# EAGLE design ADDR_ADDR_1 (EAGLE 6.5.0)
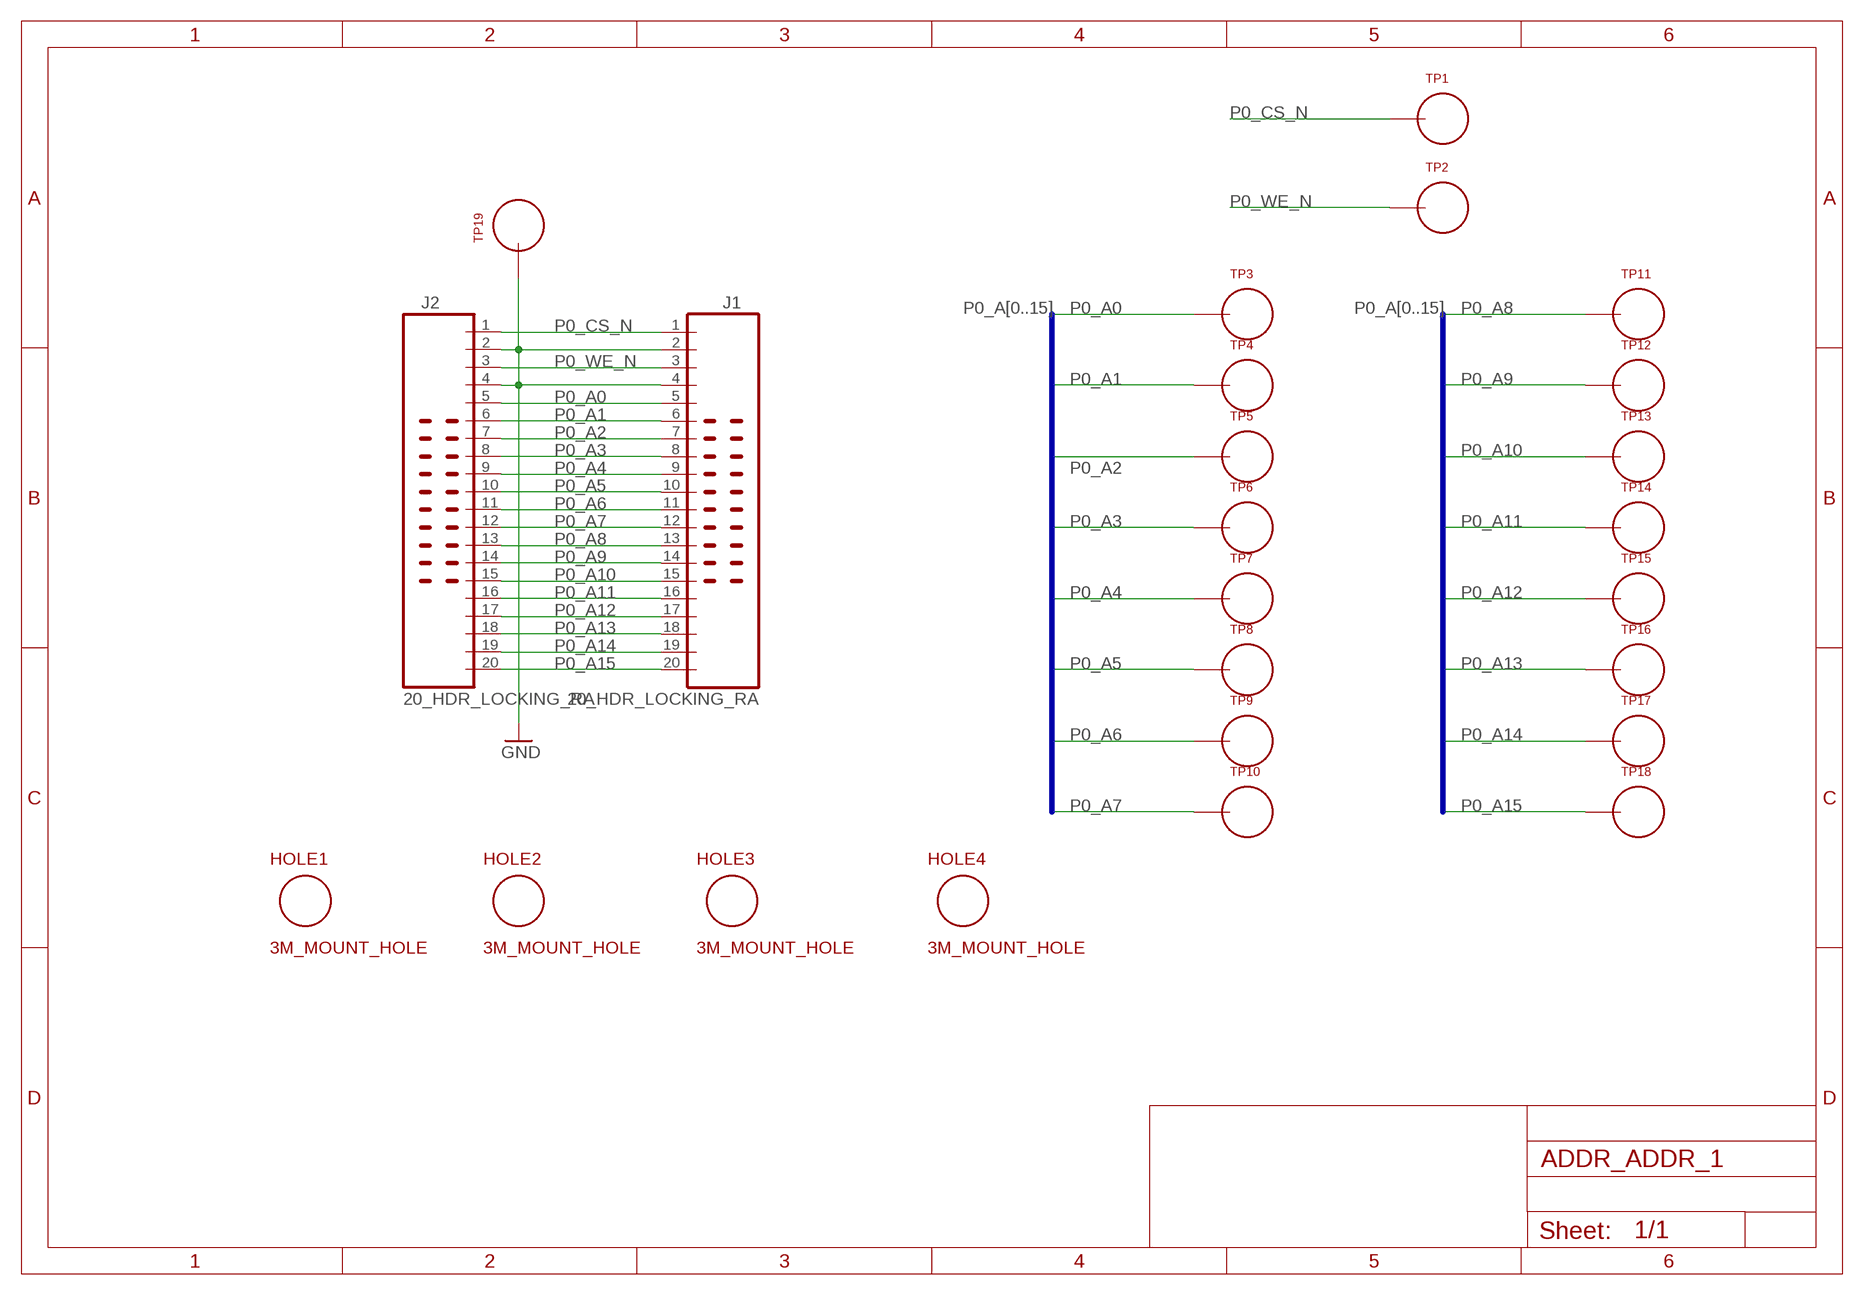
[diagram p0: schematic, sheet 1]

## Parts
HOLE1  3M_MOUNT_HOLE  [3M_HOLE]
HOLE2  3M_MOUNT_HOLE  [3M_HOLE]
HOLE3  3M_MOUNT_HOLE  [3M_HOLE]
HOLE4  3M_MOUNT_HOLE  [3M_HOLE]
J1  20_HDR_LOCKING_RA  [20_HDR_LOCKING_RA]
J2  20_HDR_LOCKING_RA  [20_HDR_LOCKING_RA]
TP1  TEST_LOOP  [TEST_LOOP]
TP2  TEST_LOOP  [TEST_LOOP]
TP3  TEST_LOOP  [TEST_LOOP]
TP4  TEST_LOOP  [TEST_LOOP]
TP5  TEST_LOOP  [TEST_LOOP]
TP6  TEST_LOOP  [TEST_LOOP]
TP7  TEST_LOOP  [TEST_LOOP]
TP8  TEST_LOOP  [TEST_LOOP]
TP9  TEST_LOOP  [TEST_LOOP]
TP10  TEST_LOOP  [TEST_LOOP]
TP11  TEST_LOOP  [TEST_LOOP]
TP12  TEST_LOOP  [TEST_LOOP]
TP13  TEST_LOOP  [TEST_LOOP]
TP14  TEST_LOOP  [TEST_LOOP]
TP15  TEST_LOOP  [TEST_LOOP]
TP16  TEST_LOOP  [TEST_LOOP]
TP17  TEST_LOOP  [TEST_LOOP]
TP18  TEST_LOOP  [TEST_LOOP]
TP19  TEST_LOOP  [TEST_LOOP]

## Nets
GND: J1.2 J1.4 J2.2 J2.4 TP19.P$1
P0_A0: J1.5 J2.5 TP3.P$1
P0_A1: J1.6 J2.6 TP4.P$1
P0_A2: J1.7 J2.7 TP5.P$1
P0_A3: J1.8 J2.8 TP6.P$1
P0_A4: J1.9 J2.9 TP7.P$1
P0_A5: J1.10 J2.10 TP8.P$1
P0_A6: J1.11 J2.11 TP9.P$1
P0_A7: J1.12 J2.12 TP10.P$1
P0_A8: J1.13 J2.13 TP11.P$1
P0_A9: J1.14 J2.14 TP12.P$1
P0_A10: J1.15 J2.15 TP13.P$1
P0_A11: J1.16 J2.16 TP14.P$1
P0_A12: J1.17 J2.17 TP15.P$1
P0_A13: J1.18 J2.18 TP16.P$1
P0_A14: J1.19 J2.19 TP17.P$1
P0_A15: J1.20 J2.20 TP18.P$1
P0_CS_N: J1.1 J2.1 TP1.P$1
P0_WE_N: J1.3 J2.3 TP2.P$1

## Buses
P0_A[0..15]

## Library data of the parts
HOLE1-HOLE4 = MyLib:3M_MOUNT_HOLE
J1 J2 = MyLib:20_HDR_LOCKING_RA
TP1-TP19 = MyLib:TEST_LOOP

## Board
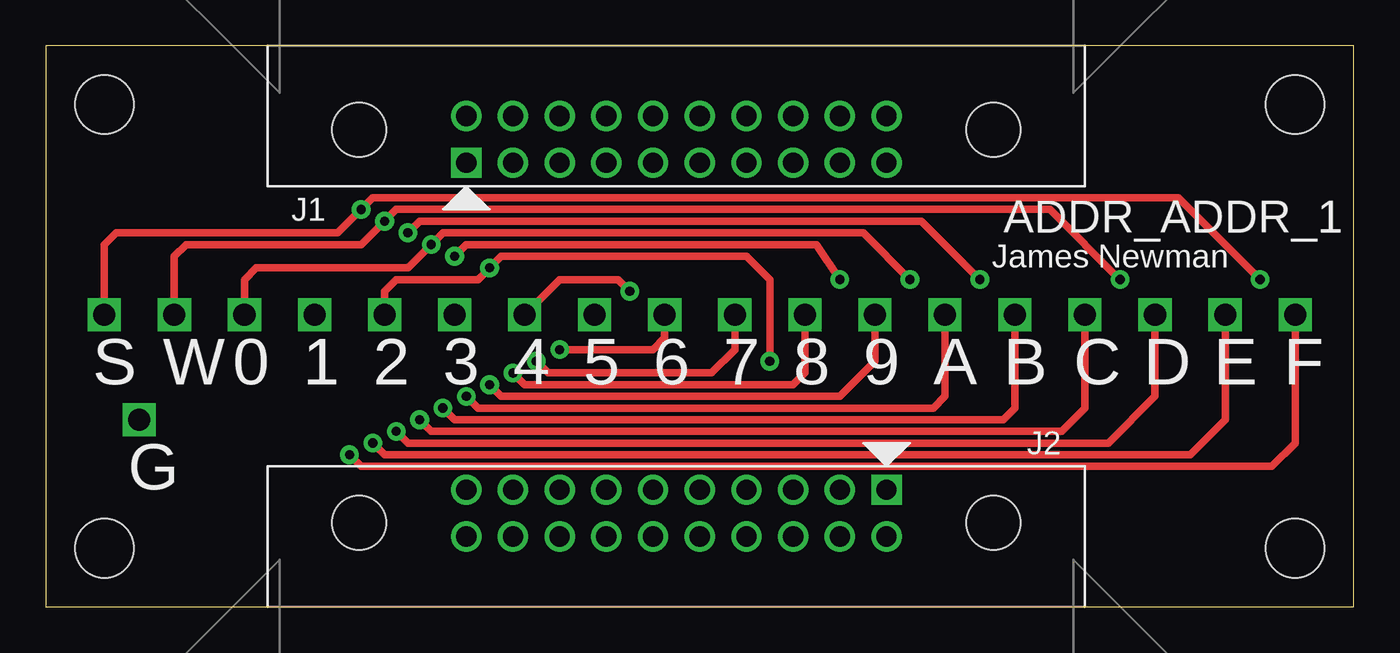
[diagram p1: board, top side]
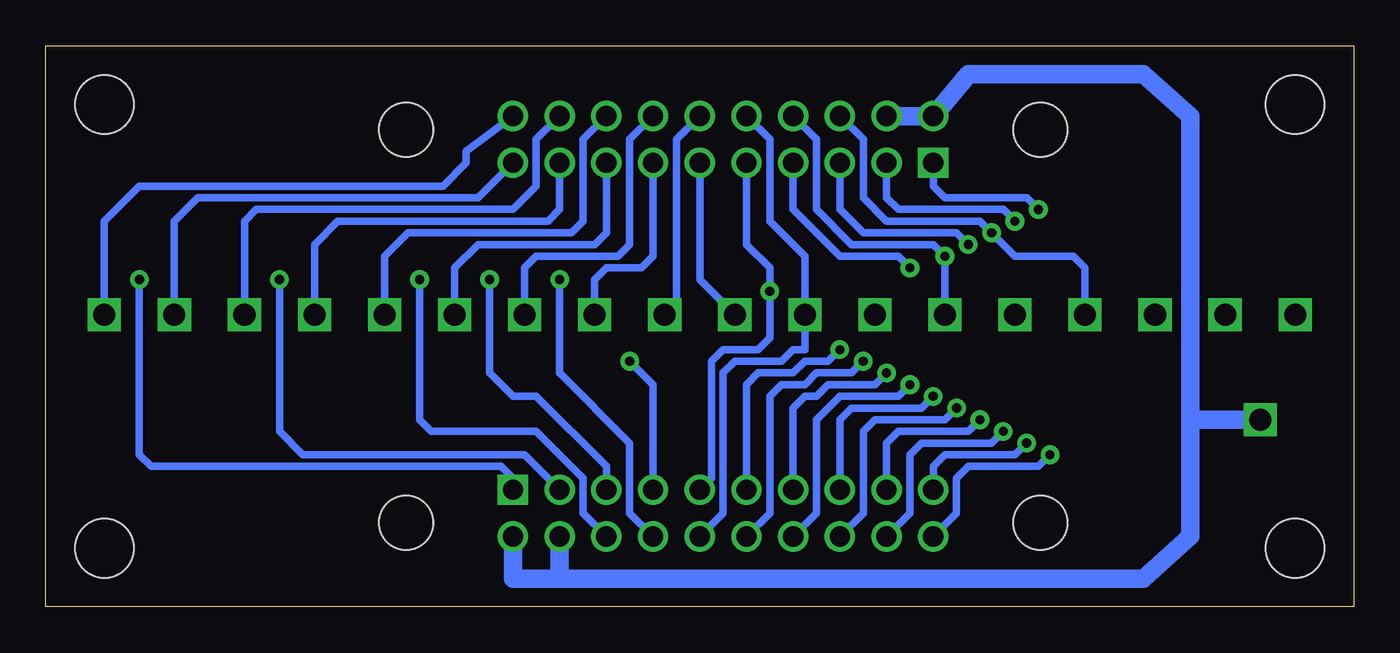
[diagram p2: board, bottom side, seen from below]

Size 71.12 x 30.48 mm. Coordinates in mm from the lower left corner, seen from the top.
Outline: 0,0 71.12,0 71.12,30.48 0,30.48 0,0
Copper layers (1*16): Top 0.035mm / dielectric 1.5mm / Bottom 0.035mm
Design rules "processor_rules_2layer": minimum track width 8mil, minimum drill 14mil, track to track 8mil, track to pad 8mil, pad to pad 8mil, via to via 8mil, smd to smd 8mil, copper to edge 40mil, drill to drill 8mil, minimum pad ring 10mil, minimum via ring 8mil, stop-mask expansion 4mil, vias tented up to drill 0.7mm, thermal gap 10mil

### Footprints (pad centres in the part's own frame; a part is rotated, then mirrored left to right if it is on the bottom)
3M_HOLE = hole 3.2: 0,0
20_HDR_LOCKING_RA = drill 1.1 square: 1 -11.43,-1.27 | drill 1.1: 2 -11.43,1.27; 3 -8.89,-1.27; 4 -8.89,1.27; 5 -6.35,-1.27; 6 -6.35,1.27; 7 -3.81,-1.27; 8 -3.81,1.27; 9 -1.27,-1.27; 10 -1.27,1.27; 11 1.27,-1.27; 12 1.27,1.27; 13 3.81,-1.27; 14 3.81,1.27; 15 6.35,-1.27; 16 6.35,1.27; 17 8.89,-1.27; 18 8.89,1.27; 19 11.43,-1.27; 20 11.43,1.27 | hole 2.946: -17.247,0.533; 17.247,0.533
TEST_LOOP = drill 1.2 square: P$1 0,0

### Placement (x,y rotation side)
HOLE1  3.17,3.17 0 top
HOLE2  3.17,27.3 0 top
HOLE3  67.94,27.3 0 top
HOLE4  67.94,3.17 0 top
J1  34.29,25.4 0 top
J2  34.29,5.08 180 top
TP1  3.17,15.88 90 top
TP2  6.99,15.88 90 top
TP3  10.79,15.88 90 top
TP4  14.61,15.88 90 top
TP5  18.41,15.88 90 top
TP6  22.23,15.88 90 top
TP7  26.04,15.88 90 top
TP8  29.84,15.88 90 top
TP9  33.66,15.88 90 top
TP10  37.47,15.88 90 top
TP11  41.27,15.88 90 top
TP12  45.09,15.88 90 top
TP13  48.9,15.88 90 top
TP14  52.7,15.88 90 top
TP15  56.52,15.88 90 top
TP16  60.33,15.88 90 top
TP17  64.14,15.88 90 top
TP18  67.94,15.88 90 top
TP19  5.08,10.16 0 top

### Tracks (layer width: path | path; a pad name or v marks a point on that pad's centre or on a via)
GND
  Bottom 1.016: 8.89,10.16 8.89,26.67 11.43,28.96 20.95,28.96 J1.2 J1.4 | 8.89,10.16 8.89,3.81 11.43,1.52 43.18,1.52 | 43.18,1.52 45.72,1.52 J2.2 | J2.4 43.18,1.52 | TP19.P$1 8.89,10.16
P0_A0  (via drill 0.5 pad 1.02)
  Top 0.406: v46.99,17.78 44.45,20.32 21.59,20.32 v20.95,19.68 19.68,18.41 11.43,18.41 10.79,17.78 TP3.P$1
  Bottom 0.406: J1.5 27.94,21.59 26.67,20.32 21.59,20.32 v20.95,19.68 | v46.99,17.78 46.99,12.7 45.72,11.43 44.45,11.43 40.64,7.62 J2.5
P0_A1  (via drill 0.5 pad 1.02)
  Top 0.406: v19.68,20.32 20.32,20.95 47.62,20.95 v50.8,17.78
  Bottom 0.406: J1.6 26.67,25.4 26.67,22.23 25.4,20.95 20.32,20.95 v19.68,20.32 18.41,19.05 15.24,19.05 14.61,18.41 TP4.P$1 | v50.8,17.78 50.8,10.16 50.16,9.53 44.45,9.53 41.91,6.99 41.91,5.08 J2.6
P0_A2  (via drill 0.5 pad 1.02)
  Top 0.406: v39.37,13.34 39.37,17.78 38.1,19.05 24.77,19.05 v24.13,18.41 23.5,17.78 19.05,17.78 18.41,17.14 TP5.P$1
  Bottom 0.406: J1.7 30.48,21.59 27.94,19.05 24.77,19.05 v24.13,18.41 | v39.37,13.34 38.1,12.06 J2.7
P0_A3  (via drill 0.5 pad 1.02)
  Top 0.406: v22.23,19.05 22.86,19.68 41.91,19.68 v43.18,17.78
  Bottom 0.406: J1.8 29.21,25.4 29.21,21.59 27.3,19.68 22.86,19.68 v22.23,19.05 TP6.P$1 | v43.18,17.78 43.18,12.7 39.37,8.89 39.37,5.08 J2.8
P0_A4  (via drill 0.5 pad 1.02)
  Top 0.406: v31.75,17.14 31.11,17.78 27.94,17.78 TP7.P$1
  Bottom 0.406: J1.9 33.02,19.68 31.75,18.41 v31.75,17.14 31.75,14.61 32.38,13.97 34.29,13.97 34.92,13.34 34.92,6.99 J2.9
P0_A5
  Bottom 0.406: J1.10 31.75,25.4 31.75,20.95 29.84,19.05 TP8.P$1 29.84,13.97 30.48,13.97 31.11,13.34 33.66,13.34 34.29,12.7 34.29,5.08 J2.10
P0_A6  (via drill 0.5 pad 1.02)
  Top 0.406: TP9.P$1 33.66,14.61 33.02,13.97 v27.94,13.97
  Bottom 0.406: J2.11 33.02,12.06 32.38,12.7 30.48,12.7 29.84,13.34 28.57,13.34 v27.94,13.97 | J1.11 35.56,17.78 TP9.P$1
P0_A7  (via drill 0.5 pad 1.02)
  Top 0.406: v26.67,13.34 27.3,12.7 36.2,12.7 37.47,13.97 TP10.P$1
  Bottom 0.406: J2.12 31.75,5.08 31.75,11.43 31.11,12.06 29.84,12.06 29.21,12.7 27.3,12.7 v26.67,13.34 | TP10.P$1 36.83,16.51 36.83,25.4 J1.12
P0_A8  (via drill 0.5 pad 1.02)
  Top 0.406: v25.4,12.7 26.04,12.06 40.64,12.06 41.27,12.7 TP11.P$1
  Bottom 0.406: J2.13 30.48,10.79 29.84,11.43 29.21,11.43 28.57,12.06 26.04,12.06 v25.4,12.7 | J1.13 38.1,19.05 38.73,18.41 40.64,18.41 41.27,17.78 TP11.P$1
P0_A9  (via drill 0.5 pad 1.02)
  Top 0.406: v24.13,12.06 24.77,11.43 43.18,11.43 45.09,13.34 TP12.P$1
  Bottom 0.406: J2.14 29.21,5.08 29.21,10.16 27.94,11.43 24.77,11.43 v24.13,12.06 | TP12.P$1 45.09,18.41 44.45,19.05 40.01,19.05 39.37,19.68 39.37,25.4 J1.14
P0_A10  (via drill 0.5 pad 1.02)
  Top 0.406: v22.86,11.43 23.5,10.79 48.26,10.79 48.9,11.43 TP13.P$1
  Bottom 0.406: J2.15 27.94,10.16 27.3,10.79 23.5,10.79 v22.86,11.43 | J1.15 40.64,20.32 41.27,19.68 47.62,19.68 48.9,18.41 TP13.P$1
P0_A11  (via drill 0.5 pad 1.02)
  Top 0.406: v21.59,10.79 22.23,10.16 52.07,10.16 52.7,10.79 TP14.P$1
  Bottom 0.406: J2.16 26.67,5.08 26.67,9.53 26.04,10.16 22.23,10.16 v21.59,10.79 | J1.16 41.91,25.4 41.91,20.95 42.55,20.32 51.44,20.32 52.7,19.05 TP14.P$1
P0_A12  (via drill 0.5 pad 1.02)
  Top 0.406: v20.32,10.16 20.95,9.53 55.24,9.53 56.52,10.79 TP15.P$1
  Bottom 0.406: J2.17 25.4,8.89 24.77,9.53 20.95,9.53 v20.32,10.16 | J1.17 43.18,21.59 43.81,20.95 55.24,20.95 56.52,19.68 TP15.P$1
P0_A13  (via drill 0.5 pad 1.02)
  Top 0.406: v19.05,9.53 19.68,8.89 57.78,8.89 60.33,11.43 TP16.P$1
  Bottom 0.406: J2.18 24.13,5.08 24.13,8.26 23.5,8.89 19.68,8.89 v19.05,9.53 | J1.18 44.45,25.4 44.45,22.86 45.72,21.59 59.69,21.59 60.33,20.95 TP16.P$1
P0_A14  (via drill 0.5 pad 1.02)
  Top 0.406: v17.78,8.89 18.41,8.26 62.23,8.26 64.14,10.16 TP17.P$1
  Bottom 0.406: J2.19 22.86,7.62 22.23,8.26 18.41,8.26 v17.78,8.89 | TP17.P$1 64.14,20.95 62.87,22.23 47.62,22.23 J1.19
P0_A15  (via drill 0.5 pad 1.02)
  Top 0.406: v16.51,8.26 17.14,7.62 66.67,7.62 67.94,8.89 TP18.P$1
  Bottom 0.406: J2.20 21.59,5.08 21.59,6.99 20.95,7.62 17.14,7.62 v16.51,8.26 | J1.20 48.26,24.77 48.26,24.13 49.53,22.86 66.04,22.86 67.94,20.95 TP18.P$1
P0_CS_N  (via drill 0.5 pad 1.02)
  Top 0.406: v66.04,17.78 61.59,22.23 17.78,22.23 v17.14,21.59 15.88,20.32 3.81,20.32 3.17,19.68 TP1.P$1
  Bottom 0.406: J1.1 22.86,22.86 22.23,22.23 17.78,22.23 v17.14,21.59 | v66.04,17.78 66.04,8.26 65.41,7.62 46.35,7.62 45.72,6.99 J2.1
P0_WE_N  (via drill 0.5 pad 1.02)
  Top 0.406: v58.42,17.78 54.61,21.59 19.05,21.59 v18.41,20.95 17.14,19.68 7.62,19.68 6.99,19.05 TP2.P$1
  Bottom 0.406: J1.3 25.4,22.23 24.77,21.59 19.05,21.59 v18.41,20.95 | v58.42,17.78 58.42,9.53 57.15,8.26 45.09,8.26 J2.3

### Text on the board
tPlace: ADDR_ADDR_1 | James Newman | S | W | 0 | 1 | 2 | 3 | 4 | 5 | 6 | 7 | 8 | 9 | A | B | C | D | E | F | G